# Altium schematic sheet SYSTEM BLOCK.SchDoc: BULLSEYE
size A2; CompanyName: TYMPHANY; DrawnBy: Yetta.He; Organization: PABU; Address1: 11F,block A, CEC building,; Address2: No.2070 Shennan Zhong road,; Address3: Huaqiang North, Futian District,; Address4: Shenzhen,  Guang Dong, P.R.C 518000; DocumentNumber: 1; Revision: 0.0.5; SheetNumber: 1; SheetTotal: 7; Size: A3; Status: DP1
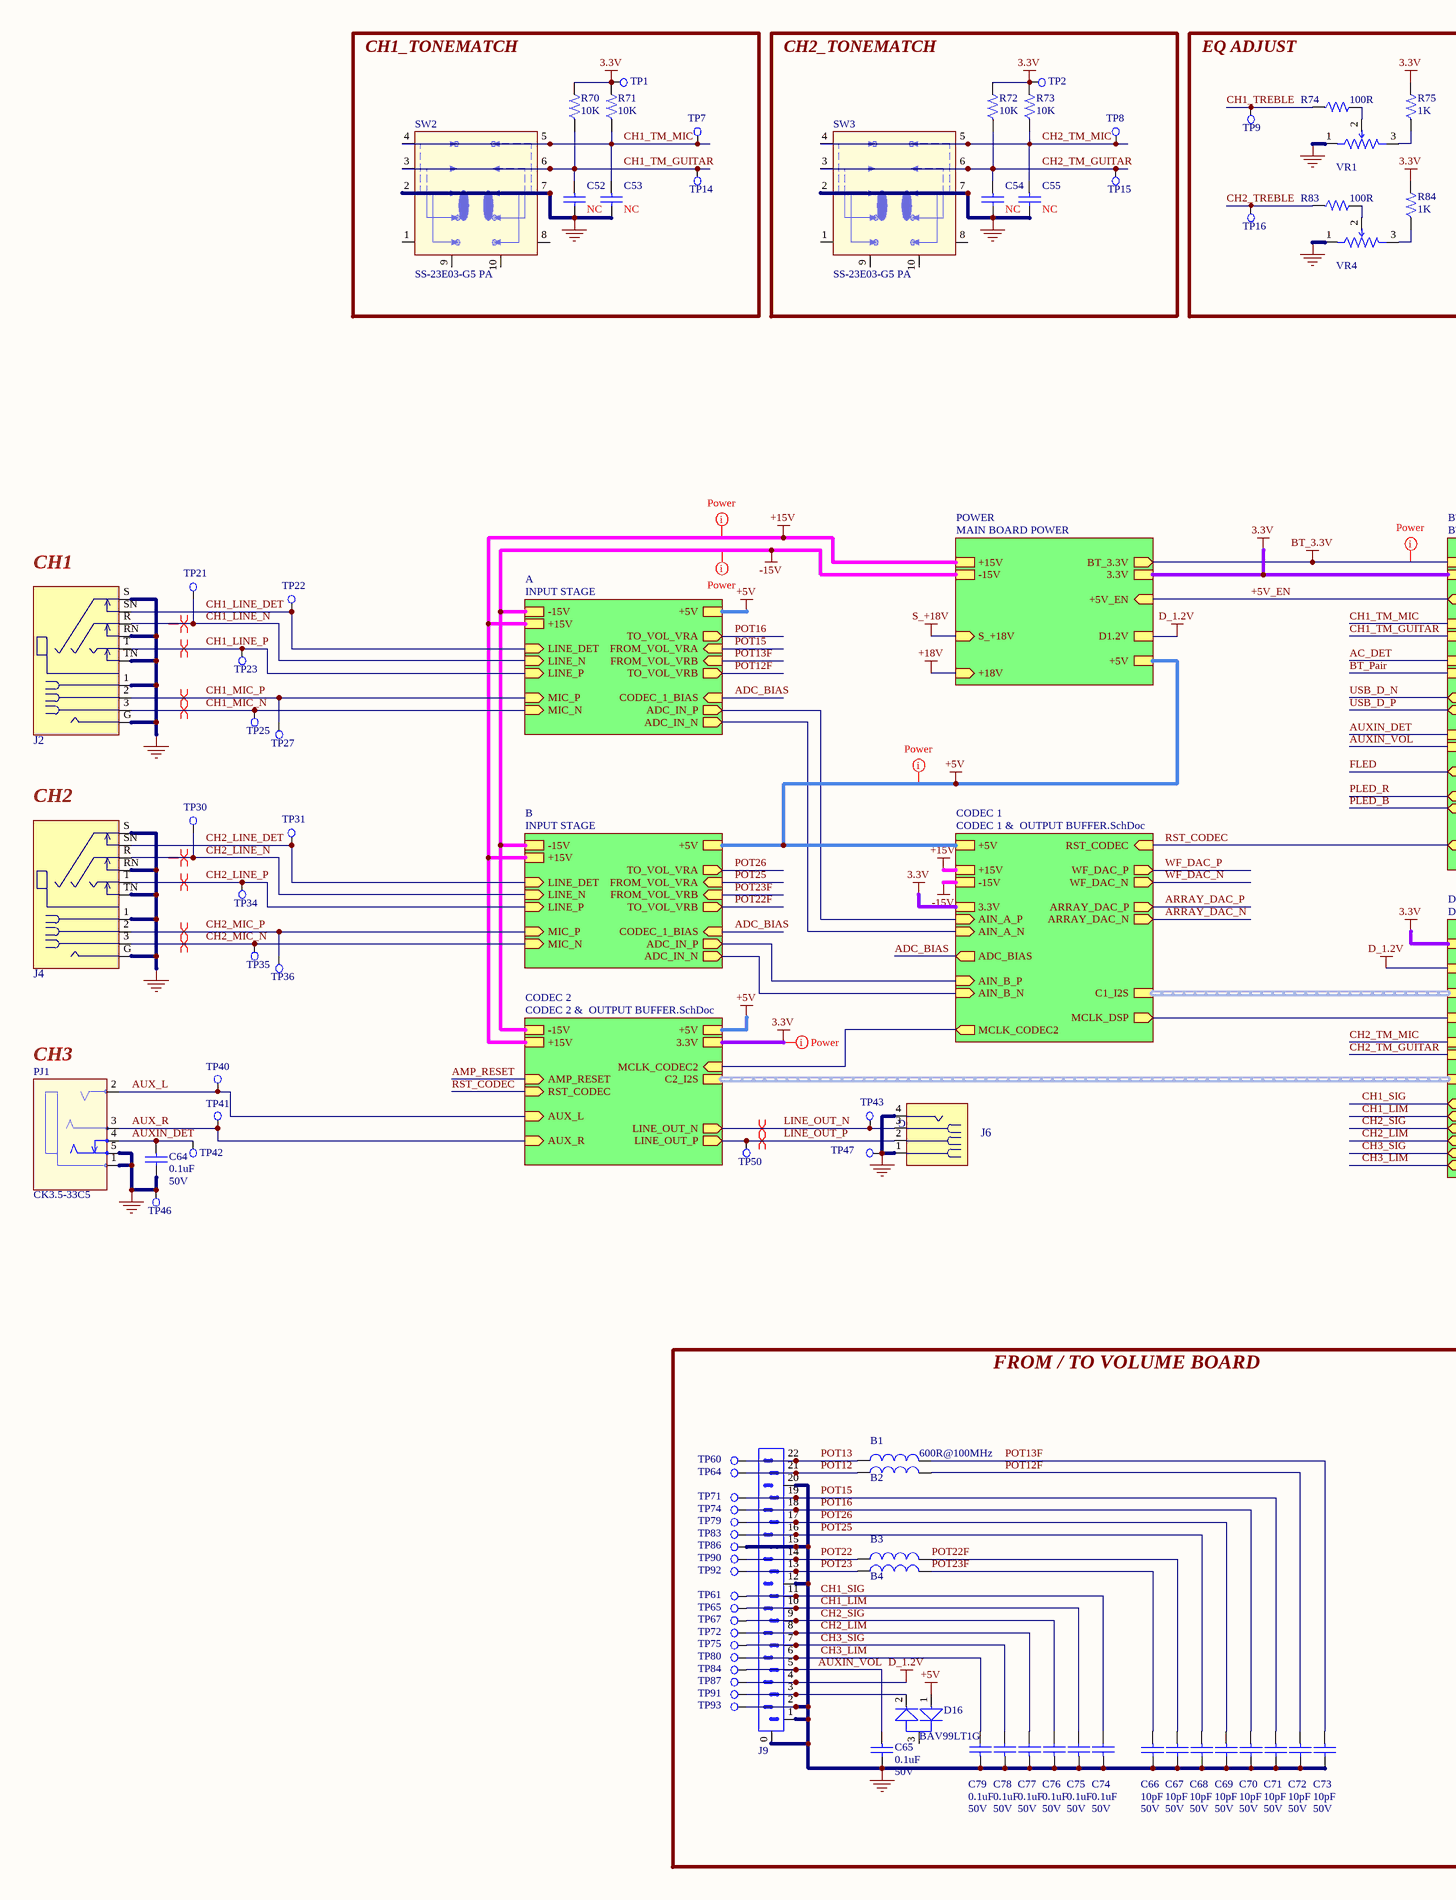
[diagram p0: SYSTEM BLOCK.SchDoc, left]
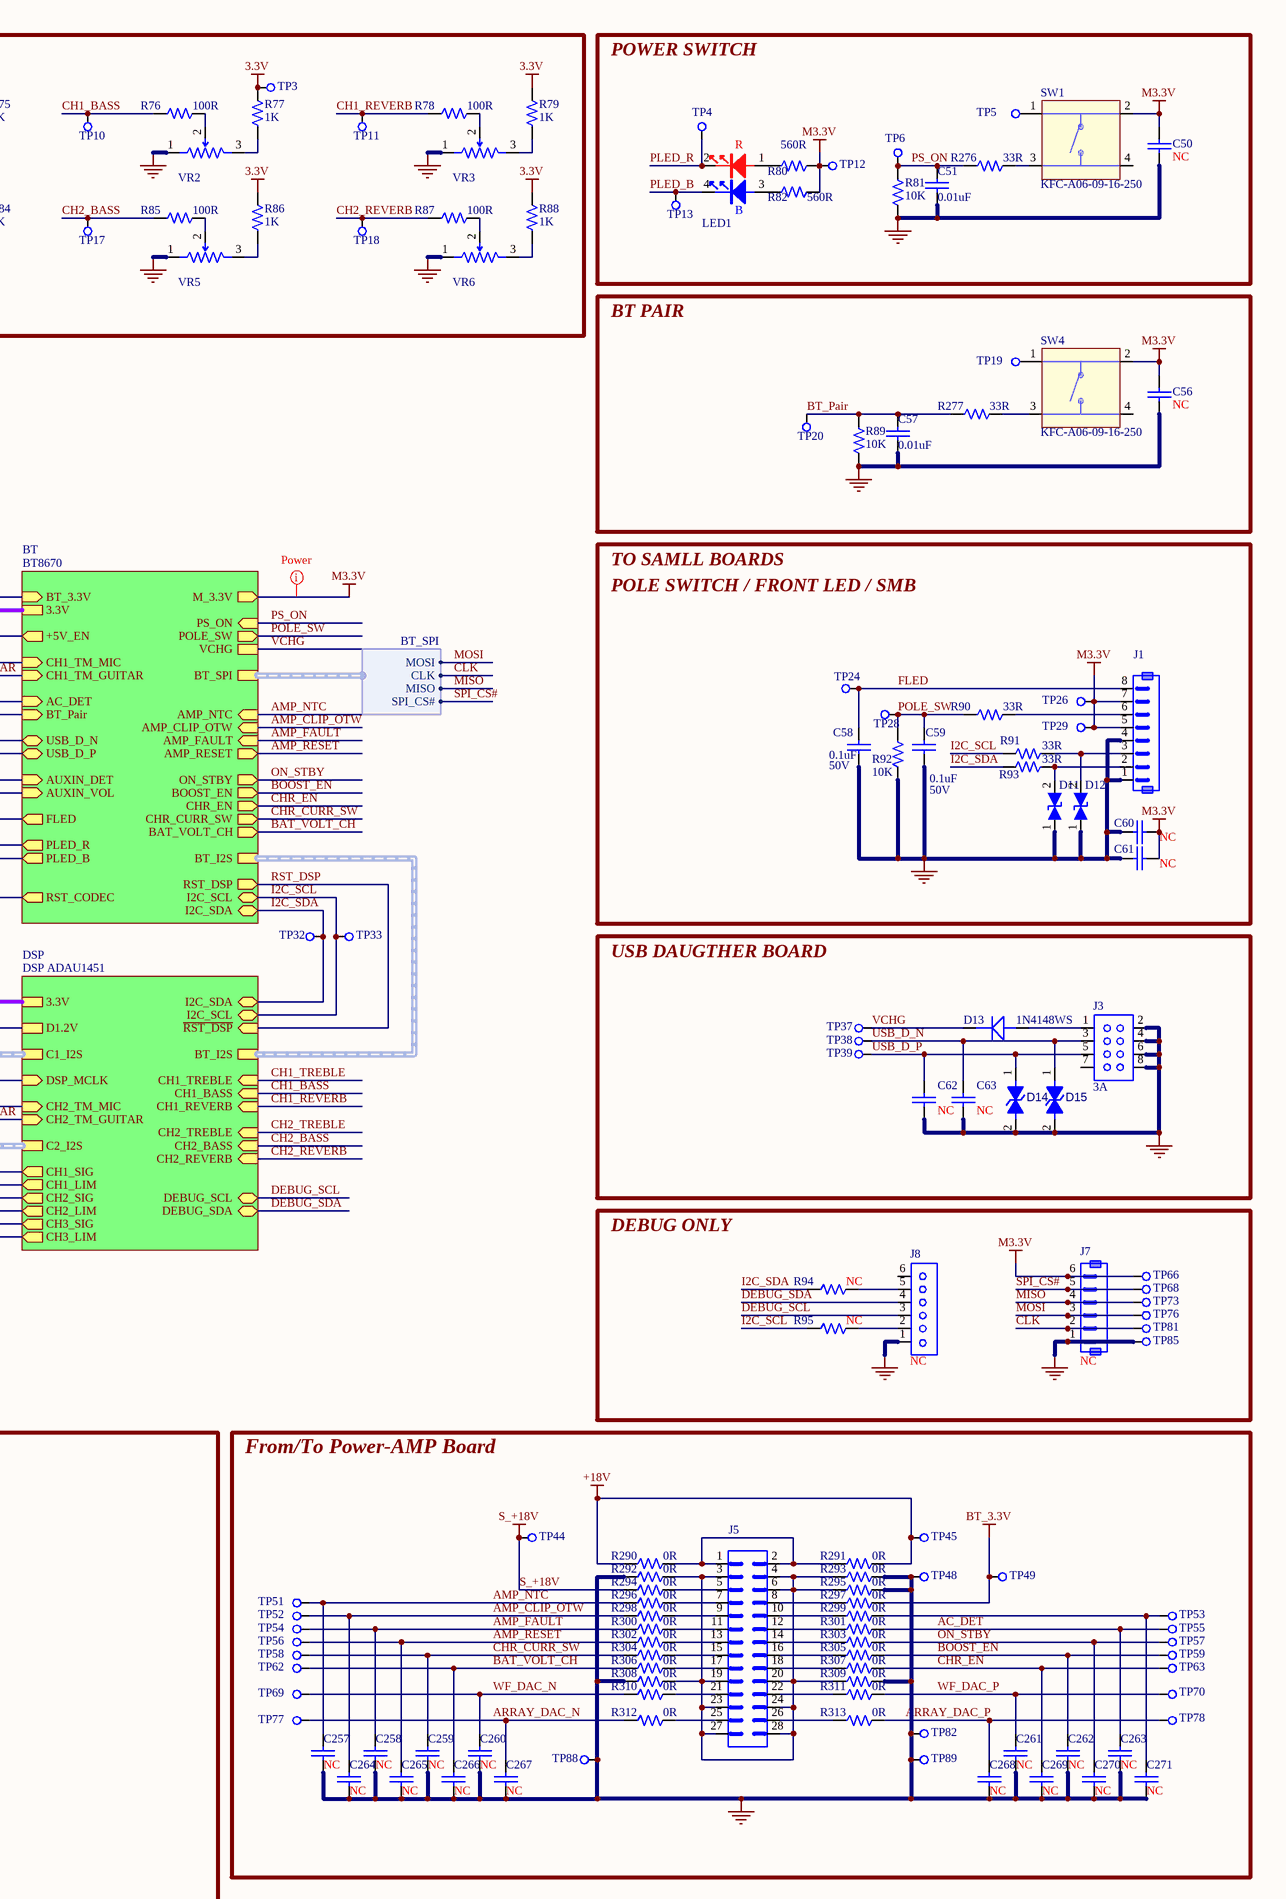
[diagram p1: SYSTEM BLOCK.SchDoc, right]

## Parts
B1  value 600R@100MHz  [L0603-RW]  (hidden comment: T710500029300)
B2  T710500029300  [L0603-RW]  (value not drawn)
B3  T710500029300  [L0603-RW]  (value not drawn)
B4  T710500029300  [L0603-RW]  (value not drawn)
C50  value NC  [CAPC0402-RW]  (hidden comment: CAP0402 NC)
C51  value 0.01uF  [CAPC0402-RW]  (hidden comment: PWL456470-1030)
C52  value NC  [CAPC0402-RW]  (hidden comment: CAP0402 NC)
C53  value NC  [CAPC0402-RW]  (hidden comment: CAP0402 NC)
C54  value NC  [CAPC0402-RW]  (hidden comment: CAP0402 NC)
C55  value NC  [CAPC0402-RW]  (hidden comment: CAP0402 NC)
C56  value NC  [CAPC0402-RW]  (hidden comment: CAP0402 NC)
C57  value 0.01uF  [CAPC0402-RW]  (hidden comment: PWL456470-1030)
C58  value 0.1uF  Voltage: 50V  [CAPC0402-RW]  (hidden comment: PWL456470-1040)
C59  value 0.1uF  Voltage: 50V  [CAPC0402-RW]  (hidden comment: PWL456470-1040)
C60  value NC  [CAPC0402-RW]  (hidden comment: CAP0402 NC)
C61  value NC  [CAPC0402-RW]  (hidden comment: CAP0402 NC)
C62  value NC  [CAPC0402-RW]  (hidden comment: CAP0402 NC)
C63  value NC  [CAPC0402-RW]  (hidden comment: CAP0402 NC)
C64  value 0.1uF  Voltage: 50V  [CAPC0402-RW]  (hidden comment: PWL456470-1040)
C65  value 0.1uF  Voltage: 50V  [CAPC0402-RW]  (hidden comment: PWL456470-1040)
C66  value 10pF  Voltage: 50V  [CAPC0402-RW]  (hidden comment: PWL410371-1000)
C67  value 10pF  Voltage: 50V  [CAPC0402-RW]  (hidden comment: PWL410371-1000)
C68  value 10pF  Voltage: 50V  [CAPC0402-RW]  (hidden comment: PWL410371-1000)
C69  value 10pF  Voltage: 50V  [CAPC0402-RW]  (hidden comment: PWL410371-1000)
C70  value 10pF  Voltage: 50V  [CAPC0402-RW]  (hidden comment: PWL410371-1000)
C71  value 10pF  Voltage: 50V  [CAPC0402-RW]  (hidden comment: PWL410371-1000)
C72  value 10pF  Voltage: 50V  [CAPC0402-RW]  (hidden comment: PWL410371-1000)
C73  value 10pF  Voltage: 50V  [CAPC0402-RW]  (hidden comment: PWL410371-1000)
C74  value 0.1uF  Voltage: 50V  [CAPC0402-RW]  (hidden comment: PWL456470-1040)
C75  value 0.1uF  Voltage: 50V  [CAPC0402-RW]  (hidden comment: PWL456470-1040)
C76  value 0.1uF  Voltage: 50V  [CAPC0402-RW]  (hidden comment: PWL456470-1040)
C77  value 0.1uF  Voltage: 50V  [CAPC0402-RW]  (hidden comment: PWL456470-1040)
C78  value 0.1uF  Voltage: 50V  [CAPC0402-RW]  (hidden comment: PWL456470-1040)
C79  value 0.1uF  Voltage: 50V  [CAPC0402-RW]  (hidden comment: PWL456470-1040)
C257  value NC  [CAPC0603-RW]  (hidden comment: CAP0603 NC)
C258  value NC  [CAPC0603-RW]  (hidden comment: CAP0603 NC)
C259  value NC  [CAPC0603-RW]  (hidden comment: CAP0603 NC)
C260  value NC  [CAPC0603-RW]  (hidden comment: CAP0603 NC)
C261  value NC  [CAPC0603-RW]  (hidden comment: CAP0603 NC)
C262  value NC  [CAPC0603-RW]  (hidden comment: CAP0603 NC)
C263  value NC  [CAPC0603-RW]  (hidden comment: CAP0603 NC)
C264  value NC  [CAPC0603-RW]  (hidden comment: CAP0603 NC)
C265  value NC  [CAPC0603-RW]  (hidden comment: CAP0603 NC)
C266  value NC  [CAPC0603-RW]  (hidden comment: CAP0603 NC)
C267  value NC  [CAPC0603-RW]  (hidden comment: CAP0603 NC)
C268  value NC  [CAPC0603-RW]  (hidden comment: CAP0603 NC)
C269  value NC  [CAPC0603-RW]  (hidden comment: CAP0603 NC)
C270  value NC  [CAPC0603-RW]  (hidden comment: CAP0603 NC)
C271  value NC  [CAPC0603-RW]  (hidden comment: CAP0603 NC)
D11  T710500020400  [VAR-0402]  (value not drawn)
D12  T710500020400  [VAR-0402]  (value not drawn)
D13  RCD114148-0020  [SOD-323]  (value not drawn)
D14  T593000120100  [SOD882-ESD]  (value not drawn)
D15  T593000120100  [SOD882-ESD]  (value not drawn)
D16  RCD100099-0010  [SOT23-132-RW]  (value not drawn)
J1  T690300162000  [CONN 8P PH=1.5mm ST SMT_ZH-8AT-JK]  (value not drawn)
J2  T710200010000  [CONN XLR COMBO RCJ9FI-V-0]  (value not drawn)
J3  Current: 3A  [USB DAUGHTER BOARD]  (hidden comment: USB DAUGHTER BOARD)
J4  T710200010000  [CONN XLR COMBO RCJ9FI-V-0]  (value not drawn)
J5  T690300164900  [HOUSING 28P 2X14 PH=2.54mm ST SMT 2.54Y-2X14SW-10.6R]  (value not drawn)
J6  T710200009900  [CONN XLR 3P NC3MAV-0]  (value not drawn)
J7  value NC  [CONN 6P PH=1.5mm ST SMT ZH-6AT-JK]  (hidden comment: T690300087900)
J8  value NC  [CONN 6P PH=2.0MM ST_PH-6A-CS]  (hidden comment: T690300108800)
J9  T690300162900  [CONN FFC 22P PH=0.5MM SMT ST 0.5S-4-22PTFAR]  (value not drawn)
LED1  KCD260004-0010  [SMTLED2.0*1.25-RGB]  (value not drawn)
PJ1  MFG Part: CK3.5-33C5  [Phone Jack CK3.5-33C5]  (hidden comment: T710200010500)
R70  value 10K  [0402-RW]  (hidden comment: QCF161240-1002)
R71  value 10K  [0402-RW]  (hidden comment: QCF161240-1002)
R72  value 10K  [0402-RW]  (hidden comment: QCF161240-1002)
R73  value 10K  [0402-RW]  (hidden comment: QCF161240-1002)
R74  value 100R  [0402-RW]  (hidden comment: QCF161240-1000)
R75  value 1K  [0402-RW]  (hidden comment: QCF161240-1001)
R76  value 100R  [0402-RW]  (hidden comment: QCF161240-1000)
R77  value 1K  [0402-RW]  (hidden comment: QCF161240-1001)
R78  value 100R  [0402-RW]  (hidden comment: QCF161240-1000)
R79  value 1K  [0402-RW]  (hidden comment: QCF161240-1001)
R80  value 560R  [0603-RW]  (hidden comment: QCF011030-5600)
R81  value 10K  [0402-RW]  (hidden comment: QCF161240-1002)
R82  value 560R  [0603-RW]  (hidden comment: QCF011030-5600)
R83  value 100R  [0402-RW]  (hidden comment: QCF161240-1000)
R84  value 1K  [0402-RW]  (hidden comment: QCF161240-1001)
R85  value 100R  [0402-RW]  (hidden comment: QCF161240-1000)
R86  value 1K  [0402-RW]  (hidden comment: QCF161240-1001)
R87  value 100R  [0402-RW]  (hidden comment: QCF161240-1000)
R88  value 1K  [0402-RW]  (hidden comment: QCF161240-1001)
R89  value 10K  [0402-RW]  (hidden comment: QCF161240-1002)
R90  value 33R  [0402-RW]  (hidden comment: QCF161241-3309)
R91  value 33R  [0402-RW]  (hidden comment: QCF161241-3309)
R92  value 10K  [0402-RW]  (hidden comment: QCF161240-1002)
R93  value 33R  [0402-RW]  (hidden comment: QCF161241-3309)
R94  value NC  [0603-RW]  (hidden comment: RES0603 NC)
R95  value NC  [0603-RW]  (hidden comment: RES0603 NC)
R276  value 33R  [0402-RW]  (hidden comment: QCF161241-3309)
R277  value 33R  [0402-RW]  (hidden comment: QCF161241-3309)
R290  value 0R  [0603-RW]  (hidden comment: QCF015030-0000)
R291  value 0R  [0603-RW]  (hidden comment: QCF015030-0000)
R292  value 0R  [0603-RW]  (hidden comment: QCF015030-0000)
R293  value 0R  [0603-RW]  (hidden comment: QCF015030-0000)
R294  value 0R  [0603-RW]  (hidden comment: QCF015030-0000)
R295  value 0R  [0603-RW]  (hidden comment: QCF015030-0000)
R296  value 0R  [0603-RW]  (hidden comment: QCF015030-0000)
R297  value 0R  [0603-RW]  (hidden comment: QCF015030-0000)
R298  value 0R  [0603-RW]  (hidden comment: QCF015030-0000)
R299  value 0R  [0603-RW]  (hidden comment: QCF015030-0000)
R300  value 0R  [0603-RW]  (hidden comment: QCF015030-0000)
R301  value 0R  [0603-RW]  (hidden comment: QCF015030-0000)
R302  value 0R  [0603-RW]  (hidden comment: QCF015030-0000)
R303  value 0R  [0603-RW]  (hidden comment: QCF015030-0000)
R304  value 0R  [0603-RW]  (hidden comment: QCF015030-0000)
R305  value 0R  [0603-RW]  (hidden comment: QCF015030-0000)
R306  value 0R  [0603-RW]  (hidden comment: QCF015030-0000)
R307  value 0R  [0603-RW]  (hidden comment: QCF015030-0000)
R308  value 0R  [0603-RW]  (hidden comment: QCF015030-0000)
R309  value 0R  [0603-RW]  (hidden comment: QCF015030-0000)
R310  value 0R  [0603-RW]  (hidden comment: QCF015030-0000)
R311  value 0R  [0603-RW]  (hidden comment: QCF015030-0000)
R312  value 0R  [0603-RW]  (hidden comment: QCF015030-0000)
R313  value 0R  [0603-RW]  (hidden comment: QCF015030-0000)
SW1  MFG Part: KFC-A06-09-16-250  [TACT SW KFC-A06-09-16-250]  (hidden comment: T670200011100)
SW2  T670600002700  [SS-23E03-G5 PA]  (value not drawn)
SW3  T670600002700  [SS-23E03-G5 PA]  (value not drawn)
SW4  MFG Part: KFC-A06-09-16-250  [TACT SW KFC-A06-09-16-250]  (hidden comment: T670200011100)
TP1  TP  [TP_1.0mm]  (value not drawn)
TP2  TP  [TP_1.0mm]  (value not drawn)
TP3  TP  [TP_1.0mm]  (value not drawn)
TP4  TP  [TP_1.0mm]  (value not drawn)
TP5  TP  [TP_1.0mm]  (value not drawn)
TP6  TP  [TP_1.2mm]  (value not drawn)
TP7  TP  [TP_1.0mm]  (value not drawn)
TP8  TP  [TP_1.0mm]  (value not drawn)
TP9  TP  [TP_1.0mm]  (value not drawn)
TP10  TP  [TP_1.0mm]  (value not drawn)
TP11  TP  [TP_1.0mm]  (value not drawn)
TP12  TP  [TP_1.0mm]  (value not drawn)
TP13  TP  [TP_1.0mm]  (value not drawn)
TP14  TP  [TP_1.0mm]  (value not drawn)
TP15  TP  [TP_1.0mm]  (value not drawn)
TP16  TP  [TP_1.0mm]  (value not drawn)
TP17  TP  [TP_1.0mm]  (value not drawn)
TP18  TP  [TP_1.0mm]  (value not drawn)
TP19  TP  [TP_1.0mm]  (value not drawn)
TP20  TP  [TP_1.0mm]  (value not drawn)
TP21  TP  [TP_1.0mm]  (value not drawn)
TP22  TP  [TP_1.0mm]  (value not drawn)
TP23  TP  [TP_1.0mm]  (value not drawn)
TP24  TP  [TP_1.0mm]  (value not drawn)
TP25  TP  [TP_1.0mm]  (value not drawn)
TP26  TP  [TP_1.0mm]  (value not drawn)
TP27  TP  [TP_1.0mm]  (value not drawn)
TP28  TP  [TP_1.0mm]  (value not drawn)
TP29  TP  [TP_1.0mm]  (value not drawn)
TP30  TP  [TP_1.0mm]  (value not drawn)
TP31  TP  [TP_1.0mm]  (value not drawn)
TP32  TP  [TP_1.0mm]  (value not drawn)
TP33  TP  [TP_1.0mm]  (value not drawn)
TP34  TP  [TP_1.0mm]  (value not drawn)
TP35  TP  [TP_1.0mm]  (value not drawn)
TP36  TP  [TP_1.0mm]  (value not drawn)
TP37  TP  [TP_1.0mm]  (value not drawn)
TP38  TP  [TP_1.0mm]  (value not drawn)
TP39  TP  [TP_1.0mm]  (value not drawn)
TP40  TP  [TP_1.0mm]  (value not drawn)
TP41  TP  [TP_1.0mm]  (value not drawn)
TP42  TP  [TP_1.0mm]  (value not drawn)
TP43  TP  [TP_1.0mm]  (value not drawn)
TP44  TP  [TP_1.0mm]  (value not drawn)
TP45  TP  [TP_1.0mm]  (value not drawn)
TP46  TP  [TP_1.0mm]  (value not drawn)
TP47  TP  [TP_1.0mm]  (value not drawn)
TP48  TP  [TP_1.0mm]  (value not drawn)
TP49  TP  [TP_1.0mm]  (value not drawn)
TP50  TP  [TP_1.0mm]  (value not drawn)
TP51  TP  [TP_1.0mm]  (value not drawn)
TP52  TP  [TP_1.0mm]  (value not drawn)
TP53  TP  [TP_1.0mm]  (value not drawn)
TP54  TP  [TP_1.0mm]  (value not drawn)
TP55  TP  [TP_1.0mm]  (value not drawn)
TP56  TP  [TP_1.0mm]  (value not drawn)
TP57  TP  [TP_1.0mm]  (value not drawn)
TP58  TP  [TP_1.0mm]  (value not drawn)
TP59  TP  [TP_1.0mm]  (value not drawn)
TP60  TP  [TP_1.0mm]  (value not drawn)
TP61  TP  [TP_1.0mm]  (value not drawn)
TP62  TP  [TP_1.0mm]  (value not drawn)
TP63  TP  [TP_1.0mm]  (value not drawn)
TP64  TP  [TP_1.0mm]  (value not drawn)
TP65  TP  [TP_1.0mm]  (value not drawn)
TP66  TP  [TP_1.0mm]  (value not drawn)
TP67  TP  [TP_1.0mm]  (value not drawn)
TP68  TP  [TP_1.0mm]  (value not drawn)
TP69  TP  [TP_1.0mm]  (value not drawn)
TP70  TP  [TP_1.0mm]  (value not drawn)
TP71  TP  [TP_1.0mm]  (value not drawn)
TP72  TP  [TP_1.0mm]  (value not drawn)
TP73  TP  [TP_1.0mm]  (value not drawn)
TP74  TP  [TP_1.0mm]  (value not drawn)
TP75  TP  [TP_1.0mm]  (value not drawn)
TP76  TP  [TP_1.0mm]  (value not drawn)
TP77  TP  [TP_1.0mm]  (value not drawn)
TP78  TP  [TP_1.0mm]  (value not drawn)
TP79  TP  [TP_1.0mm]  (value not drawn)
TP80  TP  [TP_1.0mm]  (value not drawn)
TP81  TP  [TP_1.0mm]  (value not drawn)
TP82  TP  [TP_1.0mm]  (value not drawn)
TP83  TP  [TP_1.0mm]  (value not drawn)
TP84  TP  [TP_1.0mm]  (value not drawn)
TP85  TP  [TP_1.0mm]  (value not drawn)
TP86  TP  [TP_1.0mm]  (value not drawn)
TP87  TP  [TP_1.0mm]  (value not drawn)
TP88  TP  [TP_1.0mm]  (value not drawn)
TP89  TP  [TP_1.0mm]  (value not drawn)
TP90  TP  [TP_1.0mm]  (value not drawn)
TP91  TP  [TP_1.0mm]  (value not drawn)
TP92  TP  [TP_1.0mm]  (value not drawn)
TP93  TP  [TP_1.0mm]  (value not drawn)
VR1  MVRA02101-1030  [RV09BCF-40-25F-B10K]  (value not drawn)
VR2  MVRA02101-1030  [RV09BCF-40-25F-B10K]  (value not drawn)
VR3  MVRA02101-1030  [RV09BCF-40-25F-B10K]  (value not drawn)
VR4  MVRA02101-1030  [RV09BCF-40-25F-B10K]  (value not drawn)
VR5  MVRA02101-1030  [RV09BCF-40-25F-B10K]  (value not drawn)
VR6  MVRA02101-1030  [RV09BCF-40-25F-B10K]  (value not drawn)

## Blocks framed on the sheet
CH1_TONEMATCH: C52 C53 R70 R71 SW2 TP1 TP7 TP14
CH2_TONEMATCH: C54 C55 R72 R73 SW3 TP2 TP8 TP15
EQ ADJUST: R74-R79 R83-R88 TP3 TP9-TP11 TP16-TP18 VR1-VR6
POWER SWITCH: C50 C51 LED1 R80-R82 R276 SW1 TP4-TP6 TP12 TP13
BT PAIR: C56 C57 R89 R277 SW4 TP19 TP20
USB DAUGTHER BOARD: C62 C63 D13-D15 J3 TP37-TP39
DEBUG ONLY: J7 J8 R94 R95 TP66 TP68 TP73 TP76 TP81 TP85
FROM / TO VOLUME BOARD: B1-B4 C65-C79 D16 J9 TP60 TP61 TP64 TP65 TP67 TP71 TP72 TP74 TP75 TP79 TP80 TP83 TP84 TP86 TP87 TP90-TP93
From/To Power-AMP Board: C257-C271 J5 R290-R313 TP44 TP45 TP48 TP49 TP51-TP59 TP62 TP63 TP69 TP70 TP77 TP78 TP82 TP88 TP89

## Sub-sheets
A = INPUT STAGE: -15V, LINE_N (in), LINE_P (in), +15V, CODEC_1_BIAS (in), ADC_IN_P (out), MIC_N (in), ADC_IN_N (out), MIC_P (in), LINE_DET (in), +5V, TO_VOL_VRA (out), FROM_VOL_VRA (in), TO_VOL_VRB (out), FROM_VOL_VRB (in)
B = INPUT STAGE: -15V, LINE_N (in), LINE_P (in), +15V, CODEC_1_BIAS (in), ADC_IN_P (out), MIC_N (in), ADC_IN_N (out), MIC_P (in), LINE_DET (in), +5V, TO_VOL_VRA (out), TO_VOL_VRB (out), FROM_VOL_VRA (in), FROM_VOL_VRB (in)
BT = BT8670: BT_3.3V (in), AUXIN_DET (in), AMP_RESET (out), ON_STBY (out), AMP_CLIP_OTW (in), PS_ON (in), CHR_EN (out), USB_D_N (bidir), USB_D_P (bidir), FLED (out), CHR_CURR_SW (out), BAT_VOLT_CH (out), AMP_NTC (in), AUXIN_VOL (in), POLE_SW (out), I2C_SDA (bidir), I2C_SCL (bidir), AMP_FAULT (in), BOOST_EN (out), AC_DET (in), BT_Pair (in), CH1_TM_GUITAR (in), CH1_TM_MIC (in), +5V_EN (out), RST_CODEC (out), PLED_B (out), PLED_R (out), VCHG, RST_DSP (out), 3.3V, M_3.3V (out), BT_SPI (harness BT_SPI), BT_I2S (harness BT_I2S)
CODEC 1 = CODEC 1 &  OUTPUT BUFFER.SchDoc: +5V, ADC_BIAS (out), RST_CODEC (in), AIN_A_P (in), ARRAY_DAC_P (out), WF_DAC_P (out), AIN_B_N (in), AIN_A_N (in), ARRAY_DAC_N (out), WF_DAC_N (out), AIN_B_P (in), MCLK_DSP (out), MCLK_CODEC2 (out), 3.3V, +15V, -15V, C1_I2S (harness C1_I2S)
CODEC 2 = CODEC 2 &  OUTPUT BUFFER.SchDoc: 3.3V, RST_CODEC (in), LINE_OUT_N (out), AMP_RESET (in), AUX_L (in), AUX_R (in), LINE_OUT_P (out), MCLK_CODEC2 (in), +5V, -15V, +15V, C2_I2S (harness C2_I2S)
DSP = DSP ADAU1451: 3.3V, D1.2V, DSP_MCLK (in), CH1_BASS (in), CH1_TREBLE (in), CH1_REVERB (in), CH2_REVERB (in), CH2_BASS (in), CH2_TREBLE (in), CH2_TM_GUITAR (in), CH2_TM_MIC (in), CH1_LIM (out), CH1_SIG (out), CH2_SIG (out), CH2_LIM (out), CH3_LIM (out), CH3_SIG (out), I2C_SDA (bidir), I2C_SCL (bidir), ~{RST_DSP} (in), DEBUG_SCL (bidir), DEBUG_SDA (bidir), BT_I2S (harness BT_I2S), C1_I2S (harness C1_I2S), C2_I2S (harness C2_I2S)
POWER = MAIN BOARD POWER: S_+18V (in), BT_3.3V (out), +15V, -15V, 3.3V, D1.2V, +5V_EN (in), +18V (in), +5V

## Harnesses
BT_SPI: MOSI, CLK, MISO, SPI_CS#

## Nets
3.3V: R70.2 R71.2 R72.2 R73.2 R75.2 R77.2 R79.2 R84.2 R86.2 R88.2 TP1.1 TP2.1 TP3.1 ; sheet CODEC 1/3.3V, sheet DSP/3.3V, sheet BT/3.3V, sheet POWER/3.3V, sheet CODEC 2/3.3V
+5V: D16.1(A) ; sheet A/+5V, sheet CODEC 1/+5V, sheet POWER/+5V, sheet CODEC 2/+5V, sheet B/+5V
+15V: sheet A/+15V, sheet CODEC 1/+15V, sheet POWER/+15V, sheet CODEC 2/+15V, sheet B/+15V
+18V: R290.1 R291.2 TP45.1 ; sheet POWER/+18V
-15V: sheet A/-15V, sheet CODEC 1/-15V, sheet POWER/-15V, sheet CODEC 2/-15V, sheet B/-15V
BT_3.3V: R297.2 TP49.1 ; sheet BT/BT_3.3V, sheet POWER/BT_3.3V
D_1.2V: J9.4 TP87.1 ; sheet DSP/D1.2V, sheet POWER/D1.2V
GND: C50.2 C51.1 C52.2 C53.2 C54.2 C55.2 C56.2 C57.1 C58.1 C59.1 C60.1 C61.1 C62.2 C63.2 C64.2 C65.2 C66.2 C67.2 C68.2 C69.2 C70.2 C71.2 C72.2 C73.2 C74.1 C75.1 C76.1 C77.1 C78.1 C79.1 C257.2 C258.2 C259.2 C260.2 C261.2 C262.2 C263.2 C264.2 C265.2 C266.2 C267.2 C268.2 C269.2 C270.2 C271.2 D11.1 D12.1 D14.2 D15.2 J1.1 J1.4 J2.1 J2.G J2.RN J2.S J2.TN J3.2 J3.4 J3.6 J3.8 J4.1 J4.G J4.RN J4.S J4.TN J6.1 J6.4 J7.1 J8.1 J9.0 J9.1 J9.2 J9.12 J9.15 J9.20 PJ1.1 PJ1.5 R81.2 R89.2 R92.2 R292.1 R293.2 R295.2 R308.1 R309.2 SW2.2 SW2.7 SW3.2 SW3.7 TP46.1 TP47.1 TP48.1 TP82.1 TP85.1 TP86.1 TP88.1 TP89.1 TP93.1 VR1.1 VR2.1 VR3.1 VR4.1 VR5.1 VR6.1
M3.3V: C50.1 C56.1 C60.2 C61.2 J1.5 J1.7 J7.6 R80.2 R82.2 SW1.2 SW4.2 TP12.1 TP26.1 TP29.1 TP66.1 ; sheet BT/M_3.3V
S_+18V: R294.1 TP44.1 ; sheet POWER/S_+18V
+5V_EN: sheet BT/+5V_EN, sheet POWER/+5V_EN
AC_DET: C263.1 R301.2 TP55.1 ; sheet BT/AC_DET
ADC_BIAS: sheet A/CODEC_1_BIAS, sheet CODEC 1/ADC_BIAS, sheet B/CODEC_1_BIAS
AMP_CLIP_OTW: C264.1 R298.1 TP52.1 ; sheet BT/AMP_CLIP_OTW
AMP_FAULT: C258.1 R300.1 TP54.1 ; sheet BT/AMP_FAULT
AMP_NTC: C257.1 R296.1 TP51.1 ; sheet BT/AMP_NTC
AMP_RESET: C265.1 R302.1 TP56.1 ; sheet BT/AMP_RESET, sheet CODEC 2/AMP_RESET
ARRAY_DAC_N: C267.1 R312.1 TP77.1 ; sheet CODEC 1/ARRAY_DAC_N
ARRAY_DAC_P: C268.1 R313.2 TP78.1 ; sheet CODEC 1/ARRAY_DAC_P
AUX_L: PJ1.2 TP40.1 ; sheet CODEC 2/AUX_L
AUX_R: PJ1.3 TP41.1 ; sheet CODEC 2/AUX_R
AUXIN_DET: C64.1 PJ1.4 TP42.1 ; sheet BT/AUXIN_DET
AUXIN_VOL: C65.1 J9.5 TP84.1 ; sheet BT/AUXIN_VOL
BAT_VOLT_CH: C266.1 R306.1 TP62.1 ; sheet BT/BAT_VOLT_CH
BOOST_EN: C262.1 R305.2 TP59.1 ; sheet BT/BOOST_EN
BT_Pair: C57.2 R89.1 R277.1 TP20.1 ; sheet BT/BT_Pair
CH1_BASS: R76.1 TP10.1 ; sheet DSP/CH1_BASS
CH1_LIM: C75.2 J9.10 TP65.1 ; sheet DSP/CH1_LIM
CH1_LINE_DET: J2.SN TP22.1 ; sheet A/LINE_DET
CH1_LINE_N: J2.R TP21.1 ; sheet A/LINE_N
CH1_LINE_P: J2.T TP23.1 ; sheet A/LINE_P
CH1_MIC_N: J2.3 TP25.1 ; sheet A/MIC_N
CH1_MIC_P: J2.2 TP27.1 ; sheet A/MIC_P
CH1_REVERB: R78.1 TP11.1 ; sheet DSP/CH1_REVERB
CH1_SIG: C74.2 J9.11 TP61.1 ; sheet DSP/CH1_SIG
CH1_TM_GUITAR: C52.1 R70.1 SW2.3 SW2.6 TP14.1 ; sheet BT/CH1_TM_GUITAR
CH1_TM_MIC: C53.1 R71.1 SW2.4 SW2.5 TP7.1 ; sheet BT/CH1_TM_MIC
CH1_TREBLE: R74.1 TP9.1 ; sheet DSP/CH1_TREBLE
CH2_BASS: R85.1 TP17.1 ; sheet DSP/CH2_BASS
CH2_LIM: C77.2 J9.8 TP72.1 ; sheet DSP/CH2_LIM
CH2_LINE_DET: J4.SN TP31.1 ; sheet B/LINE_DET
CH2_LINE_N: J4.R TP30.1 ; sheet B/LINE_N
CH2_LINE_P: J4.T TP34.1 ; sheet B/LINE_P
CH2_MIC_N: J4.3 TP35.1 ; sheet B/MIC_N
CH2_MIC_P: J4.2 TP36.1 ; sheet B/MIC_P
CH2_REVERB: R87.1 TP18.1 ; sheet DSP/CH2_REVERB
CH2_SIG: C76.2 J9.9 TP67.1 ; sheet DSP/CH2_SIG
CH2_TM_GUITAR: C54.1 R72.1 SW3.3 SW3.6 TP15.1 ; sheet DSP/CH2_TM_GUITAR
CH2_TM_MIC: C55.1 R73.1 SW3.4 SW3.5 TP8.1 ; sheet DSP/CH2_TM_MIC
CH2_TREBLE: R83.1 TP16.1 ; sheet DSP/CH2_TREBLE
CH3_LIM: C79.2 J9.6 TP80.1 ; sheet DSP/CH3_LIM
CH3_SIG: C78.2 J9.7 TP75.1 ; sheet DSP/CH3_SIG
CHR_CURR_SW: C259.1 R304.1 TP58.1 ; sheet BT/CHR_CURR_SW
CHR_EN: C269.1 R307.2 TP63.1 ; sheet BT/CHR_EN
CLK: J7.2 TP81.1 ; sheet BT/BT_SPI.CLK
DEBUG_SCL: J8.3 ; sheet DSP/DEBUG_SCL
DEBUG_SDA: J8.4 ; sheet DSP/DEBUG_SDA
FLED: C58.2 J1.8 TP24.1 ; sheet BT/FLED
I2C_SCL: R91.2 R95.1 TP33.1 ; sheet DSP/I2C_SCL, sheet BT/I2C_SCL
I2C_SDA: R93.2 R94.1 TP32.1 ; sheet DSP/I2C_SDA, sheet BT/I2C_SDA
LINE_OUT_N: J6.3 TP43.1 ; sheet CODEC 2/LINE_OUT_N
LINE_OUT_P: J6.2 TP50.1 ; sheet CODEC 2/LINE_OUT_P
MISO: J7.4 TP73.1 ; sheet BT/BT_SPI.MISO
MOSI: J7.3 TP76.1 ; sheet BT/BT_SPI.MOSI
ON_STBY: C270.1 R303.2 TP57.1 ; sheet BT/ON_STBY
PLED_B: LED1.4 TP13.1 ; sheet BT/PLED_B
PLED_R: LED1.2 TP4.1 ; sheet BT/PLED_R
POLE_SW: C59.2 R90.1 R92.1 TP28.1 ; sheet BT/POLE_SW
POT12: B2.1 J9.21 TP64.1
POT12F: B2.2 C72.1 ; sheet A/TO_VOL_VRB
POT13: B1.1 J9.22 TP60.1
POT13F: B1.2 C73.1 ; sheet A/FROM_VOL_VRB
POT15: C71.1 J9.19 TP71.1 ; sheet A/FROM_VOL_VRA
POT16: C70.1 J9.18 TP74.1 ; sheet A/TO_VOL_VRA
POT22: B3.1 J9.14 TP90.1
POT22F: B3.2 C67.1 ; sheet B/TO_VOL_VRB
POT23: B4.1 J9.13 TP92.1
POT23F: B4.2 C66.1 ; sheet B/FROM_VOL_VRB
POT25: C68.1 J9.16 TP83.1 ; sheet B/FROM_VOL_VRA
POT26: C69.1 J9.17 TP79.1 ; sheet B/TO_VOL_VRA
PS_ON: C51.2 R81.1 R276.1 TP6.1 ; sheet BT/PS_ON
RST_CODEC: sheet CODEC 1/RST_CODEC, sheet BT/RST_CODEC, sheet CODEC 2/RST_CODEC
RST_DSP: sheet DSP/~{RST_DSP}, sheet BT/RST_DSP
SPI_CS#: J7.5 TP68.1 ; sheet BT/BT_SPI.SPI_CS#
USB_D_N: C63.1 D15.1 J3.3 TP38.1 ; sheet BT/USB_D_N
USB_D_P: C62.1 D14.1 J3.5 TP39.1 ; sheet BT/USB_D_P
VCHG: D13.2(K) TP37.1 ; sheet BT/VCHG
WF_DAC_N: C260.1 R310.1 TP69.1 ; sheet CODEC 1/WF_DAC_N
WF_DAC_P: C261.1 R311.2 TP70.1 ; sheet CODEC 1/WF_DAC_P
NetC271_1: C271.1 R299.2 TP53.1
NetD11_2: D11.2 J1.2 R93.1
NetD12_2: D12.2 J1.3 R91.1
NetD13_1: D13.1(A) J3.1
NetD16_2: D16.2(K) J9.3 TP91.1
NetJ1_6: J1.6 R90.2
NetJ5_1: J5.1 J5.2 R290.2 R291.1
NetJ5_3: J5.3 J5.4 J5.6 J5.19 J5.20 J5.23 J5.24 J5.27 J5.28 R292.2 R293.1 R295.1 R308.2 R309.1
NetJ5_5: J5.5 R294.2
NetJ5_7: J5.7 R296.2
NetJ5_8: J5.8 R297.1
NetJ5_9: J5.9 R298.2
NetJ5_10: J5.10 R299.1
NetJ5_11: J5.11 R300.2
NetJ5_12: J5.12 R301.1
NetJ5_13: J5.13 R302.2
NetJ5_14: J5.14 R303.1
NetJ5_15: J5.15 R304.2
NetJ5_16: J5.16 R305.1
NetJ5_17: J5.17 R306.2
NetJ5_18: J5.18 R307.1
NetJ5_21: J5.21 R310.2
NetJ5_22: J5.22 R311.1
NetJ5_25: J5.25 R312.2
NetJ5_26: J5.26 R313.1
NetJ8_2: J8.2 R95.2
NetJ8_5: J8.5 R94.2
NetLED1_1: LED1.1 R80.1
NetLED1_3: LED1.3 R82.1
NetR74_2: R74.2 VR1.2
NetR75_1: R75.1 VR1.3
NetR76_2: R76.2 VR2.2
NetR77_1: R77.1 VR2.3
NetR78_2: R78.2 VR3.2
NetR79_1: R79.1 VR3.3
NetR83_2: R83.2 VR4.2
NetR84_1: R84.1 VR4.3
NetR85_2: R85.2 VR5.2
NetR86_1: R86.1 VR5.3
NetR87_2: R87.2 VR6.2
NetR88_1: R88.1 VR6.3
NetR276_2: R276.2 SW1.3
NetR277_2: R277.2 SW4.3
NetSW1_1: SW1.1 TP5.1
NetSW4_1: SW4.1 TP19.1
(unnamed): sheet A/ADC_IN_P, sheet CODEC 1/AIN_A_P
(unnamed): sheet A/ADC_IN_N, sheet CODEC 1/AIN_A_N
(unnamed): sheet CODEC 1/AIN_B_N, sheet B/ADC_IN_N
(unnamed): sheet CODEC 1/AIN_B_P, sheet B/ADC_IN_P
(unnamed): sheet CODEC 1/MCLK_DSP, sheet DSP/DSP_MCLK
(unnamed): sheet CODEC 1/MCLK_CODEC2, sheet CODEC 2/MCLK_CODEC2

Not connected (* = marked no-connect by the designer): D16 3; J3 7; J8 6; SW1 4; SW2 1 8 9 10; SW3 1 8 9 10; SW4 4

## Buses and harness runs
harness sheet BT/BT_I2S = sheet DSP/BT_I2S
harness sheet CODEC 1/C1_I2S = sheet DSP/C1_I2S
harness sheet CODEC 2/C2_I2S = sheet DSP/C2_I2S

## Layout directives
differential pair: CH1_LINE_N, CH1_LINE_P, CH1_MIC_N, CH1_MIC_P, CH2_LINE_N, CH2_LINE_P, CH2_MIC_N, CH2_MIC_P, LINE_OUT_N, LINE_OUT_P
net class Power: 3.3V, +5V, +15V, -15V, BT_3.3V, M3.3V

## Notes on the sheet
- CH1
- TO SAMLL BOARDS
- POLE SWITCH / FRONT LED / SMB
- CH2
- CH3
- Client
- Premium Loudspeakers
- (Hui Zhou) Co. Ltd., Shenzhen Branch
- Board:
- Description of change/Notes:
- REV
- 11F,block A, CEC building,
- No.2070 Shennan Zhong road,
- Huaqiang North, Futian District,
- Shenzhen,  Guang Dong, P.R.C 518000
- Tel: +86 755-339-121-88
- www.tymphany.com <http://www.tymphany.com>
- Status:
- Revision:
- Product:
- Date:
- Approved By:
- DP0
- Modified By:
- Drawn By:
- Time:
- Sheet
- PCB By:
- Checked By:
- Size:
- of
- (in symbol CONN XLR 3P NC3MAV-0) G
- (in symbol MS-PTB2012CURSGAC_RED/BLUE) R; B

## Library data of the parts
B1-B4 = BEAD 0603 600R@100MHz BLM18KG601SN1D: BEAD BLM18KG601SN1D 600 OHM 100M 1A L; MFG: MURATA; Current: 1.3A (at 85 degree); Test Frequency: 100MHZ; DIP&SMD: SMD; CREATE_NAME: Nathan; SAP: T710500029300; Vendor Code: *; Vendor Name: *; MFG Part: BLM18KG601SN1D; Type: INDUCTOR; CREATE_TIME: 15-MAR-2019
  B2-B4: VALUE: 600R@100MHz
C50 C52-C56 C60-C63 = CAP0402 NC: NC; Type: Capacitor; CREATE_NAME: Tom; DIP&SMD: SMD; SAP: *; PACKAGE: CAPC0402; Vendor Code: *; Vendor Name: *; MFG: *; MFG Part: *; Other: *; Tolerance: *; CREATE_TIME: 18-Mar-2016; Voltage: *; Customer Specific: N/A
C51 C57 = CAP0402 0.01uF 50V 10%: CAP, CER, 0.01uF, 10%, 50V, X7R, 0402, RoHS; SAP: T542011037508; Type: Capacitor; CREATE_NAME: Evan@Deftronics; PACKAGE: CAPC0402; Vendor Name: *; MFG: *; MFG Part: *; Other: X7R; Tolerance: 10%; CREATE_TIME: 26-May-2014; Voltage: 50V
C58 C59 C64 C65 C74-C79 = CAP0402 0.1uF 50V 10%: CAP, CER, 0.1uF, 10%, 50V, X7R, 0402, RoHS; SAP: T542011047508; Type: Capacitor; CREATE_NAME: TOM@Deftronics; PACKAGE: CAPC0402; Vendor Name: *; MFG: *; MFG Part: *; Other: X7R; Tolerance: 10%; CREATE_TIME: 13-May-2014
C66-C73 = CAP0402 10pF 50V 5%: CHIP CAP 5% 50V 0402 NPO 10pF; SAP: T541011006508; Type: Capacitor; CREATE_NAME: TOM@Deftronics; PACKAGE: CAPC0402; Vendor Code: *; Vendor Name: *; MFG: *; MFG Part: *; Other: *; Tolerance: 5%; CREATE_TIME: 06-Aug-2013
C257-C271 = CAP0603 NC: NC; Type: Capacitor; CREATE_NAME: Tom; DIP&SMD: SMD; SAP: *; PACKAGE: CAPC0603; Vendor Code: *; Vendor Name: *; MFG: *; MFG Part: *; Other: *; Tolerance: *; CREATE_TIME: 18-Mar-2016; Voltage: *; Customer Specific: N/A
D11 D12 = AVRM1005C120MTAAB: VR AVRM1005C120MTAAB TDK K; Type: Zener DIODE; CREAT NAME: QCD; DIP&SMD: SMD; SAP: T710500020400; MFG: TDK; Vendor Code: *; Vendor Name: *; CREAT TIME: 02-Sep-2016; MFG Part: AVRM1005C120MTAAB
D13 = 1N4148WS: DIODE SW 1N4148 VF=0.7V SOD-323; MFG: TW SEMICONDUCTOR; SAP: T572005070208; Voltage: 100V; Current: 150MA; Vendor Name: *; Vendor Code: *; Type: DIODE; Package: SOD-323; MFG Part: 1N4148WS
D14 D15 = L06ESDU5V0CE2: TVS 5V L06ESDU5V0CE SMD LITEON L; Type: ESD; CREATE_NAME: Tom; Vendor Code: *; Vendor Name: *; SAP: T593000120100; CREATE_TIME: 24-Feb-2016; MFG: LITEON; MFG Part: L06ESDU5V0CE2
D16 = BAV99LT1G: SWITC 70V 215MA BAV99LT1G ON SE G; MFG: ON SEMI; SAP: T572003550122; Type: DIODE; Voltage: 100V; Power: 225MW; DIP&SMD: SMD; Vendor Name: *; Vendor Code: *; MFG Part: BAV99LT1G; Current: 215mA; Customer Specific: N/A; Package: SOT-23
J1 = CONN 8P PH=1.5mm ST SMT_ZH-8AT-JK: SMT CONNECTOR 8PIN P:1.5MM 90 K; Value: 1.5mm; MFG: 金佳; CREATE_NAME: Nathan; DIP&SMD: SMD; SAP: T690300162000; MFG Part: ZH-8AT-JK; Vendor Name: *; Vendor Code: *; Type: Connector; CREATE_TIME: 14-Nov-2018; Current: *; Customer Specific: N/A
J2 J4 = CONN XLR COMBO RCJ9FI-V-0: COMBO JACK RCJ9FI-V-0 REAN K; CREATE_NAME: Nathan; SAP: T710200010000; MFG: REAN; Vendor Name: *; Vendor Code: *; Type: Connector; CREATE_TIME: 31-May-2016; MFG Part: RCJ9FI-V-0
J3 = USB DAUGHTER BOARD: Value: 2.54mm; DIP&SMD: DIP; MFG: *; MFG Part: *; Type: Connector
J5 = HOUSING 28P 2X14 PH=2.54mm ST SMT 2.54Y-2X14SW-10.6R: CONNECTOR 2X14PIN P:2.54 90 H:10.6 K; MFG: JIN JIA; CREATE_NAME: Nathan; DIP&SMD: SMD; SAP: T690300164900; MFG Part: 2.54Y-2X14SW-10.6R; Vendor Name: *; Vendor Code: *; Value: *; Voltage: *; CREATE_TIME: 11-Apr-2019; Type: Connector; Current: *; Customer Specific: N/A
J6 = CONN XLR 3P NC3MAV-0: 3 POLE MALE XLR RECEPTACLE K; MFG: NEUTRIK; CREATE_NAME: Nathan; DIP&SMD: DIP; SAP: T710200009900; Vendor Name: *; Vendor Code: *; Type: Connector; CREATE_TIME: 20-Mar-2017; MFG Part: NC3MAV-0
J7 = CONN 6P PH=1.5mm ST SMT ZH-6AT-JK: CHIP CONNECTOR 6PIN P:1.5MM 90 G; SAP: DNI; MFG: 金佳; CREATE_NAME: Nathan; MFG Part: ZH-6AT-JK; Vendor Name: *; Vendor Code: *; Type: Connector; CREATE_TIME: 20-OCT-2016; Current: *
J8 = CONN 6P PH=2.0MM ST_PH-6A-CS: CONNECTOR 6IN 2.0MM DIP 180 K; SAP: DNI; MFG: 金佳电子; CREATE_NAME: Nathan; Vendor Name: *; Vendor Code: *; CREATE_TIME: 10-May-2017; MFG Part: PH-6A-CS; Type: Connector; Current: *
J9 = CONN FFC 22P 2X11 PH=0.5MM SMT ST 0.5S-4-22PTFAR: FFC CONNECTOR 22P 0.5MM GOLD PLATED L; MFG: 金佳; CREATE_NAME: Nathan; Current: 0.5A; DIP&SMD: SMD; SAP: T690300162900; MFG Part: 0.5S-4-22PTFAR; Vendor Name: *; Vendor Code: *; Type: Connector; CREATE_TIME: 19-Mar-2019; Value: 0.5mm
LED1 = MS-PTB2012CURSGAC_RED/BLUE: SMD LED 2.0x1.25mm  MS-PTB2012CURSBAC   RED/BLUE; MFG Part: MS-PTB2012CURSGAC  RED/BLUE; SAP: T575009310253; MFG: MASON; CREATE_NAME: Evan@Deftronics; Vendor Code: *; Vendor Name: *; Type: LED; CREATE_TIME: 28-Apr-2014
PJ1 = PHONE JACK 3.5mm CK3.5-33C5: EARPHONE JACK K; MFG: JINJIA; Value: 3.5mm; CREATE_NAME: Nathan; SAP: T710200010500; Vendor Code: *; Vendor Name: *; Type: Connector; CREATE_TIME: 11-Oct-2015
R70-R73 R81 R89 = RES0402 1/16W 1% 10K OHM: CHIP RES 10K OHM 1/16W 1% 0402; SAP: T502100201399; MFG: WALSIN; Vendor Code: *; Power: *; Vendor Name: *; MFG Part: *; TOL: 1%; Type: Resistor; PACKAGE: 0402
R74 R76 R78 R83 R85 R87 = RES0402 1/16W 1% 100 OHM: CHIP RES 100 OHM 1/16W 1% 0402; SAP: T502100001399; MFG: WALSIN; Vendor Code: *; Power: *; Vendor Name: *; MFG Part: *; TOL: 1%; Type: Resistor; PACKAGE: 0402
R75 R77 R79 R84 R86 R88 = RES0402 1/16W 1% 1K OHM: CHIP RES 1K OHM 1/16W 1% 0402; SAP: T502100101399; MFG: WALSIN; Vendor Code: *; Power: *; Vendor Name: *; MFG Part: *; TOL: 1%; Type: Resistor; PACKAGE: 0402
R80 R82 = RES0603 1/10W 1% 560 OHM: GP CHIP RES. 560 OHM 1/10W 1% 0603; Vendor Code: 10010262; SAP: T502560002399; Vendor Name: 东莞市晴远电子有限公司; Power: *; MFG Part: *; MFG: *; TOL: 1%; Type: Resistor; PACKAGE: 0603
R90 R91 R93 R276 R277 = RES0402 1/16W 1% 33 OHM: CHIP RES 33 OHM 1/16W 1% 0402; SAP: T502330A01399; MFG: WALSIN; DIP&SMD: SMD; Vendor Code: *; Power: 1/16W; Vendor Name: *; MFG Part: *; TOL: 1%; Type: Resistor; PACKAGE: 0402; Customer Specific: N/A
R92 = RES0402 1/16W 1% 10K OHM: CHIP RES 10K OHM 1/16W 1% 0402; SAP: T502100201399; MFG: WALSIN; DIP&SMD: SMD; Vendor Code: *; Power: 1/16W; Vendor Name: *; MFG Part: *; TOL: 1%; Type: Resistor; PACKAGE: 0402; Customer Specific: N/A
R94 R95 = RES0603 NC: NC; CREATE_NAME: Tom; DIP&SMD: SMD; SAP: *; Tolerance: *; MFG Part: *; MFG: *; Vendor Code: *; Vendor Name: *; Type: Resistor; Power: *; CREATE_TIME: 18-Mar-2016; Customer Specific: N/A; Package: 0603
R290-R313 = RES0603 1/10W 5% 0 OHM: GP CHIP RES. 0 OHM 1/10W 5% 0603; Vendor Code: 10010262; SAP: T5020000024A9; Vendor Name: 东莞市晴远电子有限公司; DIP&SMD: SMD; Power: 1/10W; MFG Part: *; MFG: *; TOL: 5%; Type: Resistor; PACKAGE: 0603; Customer Specific: N/A
SW1 SW4 = TACT SW KFC-A06-09-16-250: TACT SWITCH 50MA\12VDC KFC-A06-09-16-2 K; MFG: JIN JIA; CREATE_NAME: Tom; DIP&SMD: SMD; SAP: T670200011100; Vendor Code: *; Vendor Name: *; Value: TACT; Current: *; Voltage: *; Type: Switch; CREATE_TIME: 04-May-2018; Customer Specific: N/A
SW2 SW3 = SS-23E03-G5 PA: SLIDE SWITCH 8P SS-23E03-G PA K; MFG: C&K; Value: 2P3T; Voltage: 50V; CREATE_NAME: Nathan; SAP: T670600002700; Vendor Code: *; Vendor Name: *; Current: *; Type: Switch; CREATE_TIME: 15-Mar-2017; MFG Part: SS-23E03-G5 PA
VR1-VR6 = RV09BCF-40-25F-B10K: ROTARY 10k OHM RV09BCF-40-25F-B10K; SAP: T531220003000; MFG: 艾华电子; CREATE_NAME: Evan@Deftronics; Vendor Code: *; Vendor Name: *; Value: 10K; Type: Switch; CREATE_TIME: 29-Apr-2014; MFG Part: RV09BCF-40-25F-B10K
TP1-TP93 = TP
  TP1-TP5 TP7-TP93: DIP&SMD: TP; Customer Specific: N/A